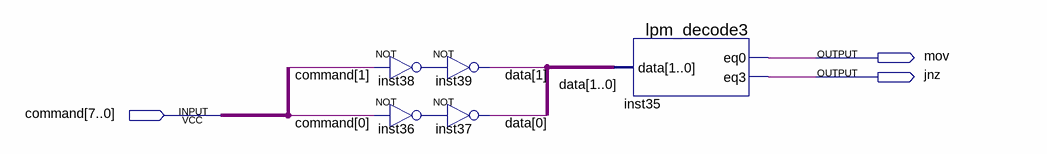
[diagram p0: schematic sheet]
// Quartus schematic decode_code_operation.bdf as structural Verilog: 5 symbols, 3 pins
module decode_code_operation (
  input  [7:0] command,
  output mov,
  output jnz
);

  wire inst36_out, inst38_out;
  wire [1:0] data;

  not inst38 (inst38_out, command[1]);
  not inst36 (inst36_out, command[0]);
  not inst39 (data[1], inst38_out);
  not inst37 (data[0], inst36_out);
  lpm_decode3 inst35 (.data(data), .eq0(mov), .eq3(jnz));
endmodule
